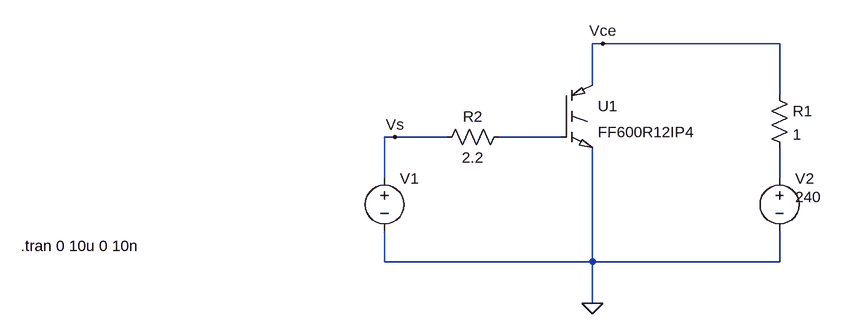
[diagram p0: schematic igbt-test.asc]
igbt-test.asc, the LTspice schematic file:
Version 4
SHEET 1 3552 680
WIRE 496 48 480 48
WIRE 768 48 496 48
WIRE 480 112 480 48
WIRE 768 128 768 48
WIRE 176 192 160 192
WIRE 256 192 176 192
WIRE 432 192 336 192
WIRE 160 256 160 192
WIRE 768 256 768 208
WIRE 160 384 160 336
WIRE 480 384 480 208
WIRE 480 384 160 384
WIRE 768 384 768 336
WIRE 768 384 480 384
WIRE 480 448 480 384
FLAG 480 448 0
FLAG 176 192 Vs
FLAG 496 48 Vce
SYMBOL voltage 160 240 R0
WINDOW 123 0 0 Left 0
WINDOW 39 0 0 Left 0
WINDOW 3 24 96 Invisible 2
SYMATTR Value PULSE(0 15 1u 1n 1n 5u 10u 2)
SYMATTR InstName V1
SYMBOL voltage 768 240 R0
WINDOW 3 24 44 Left 2
WINDOW 123 0 0 Left 0
WINDOW 39 0 0 Left 0
SYMATTR Value 240
SYMATTR InstName V2
SYMBOL res 752 112 R0
SYMATTR InstName R1
SYMATTR Value 1
SYMBOL res 352 176 R90
WINDOW 0 0 56 VBottom 2
WINDOW 3 32 56 VTop 2
SYMATTR InstName R2
SYMATTR Value 2.2
SYMBOL FF600R12IP4 432 112 R0
SYMATTR InstName U1
TEXT -400 360 Left 2 !.tran 0 10u 0 10n

The netlist it stands for:
* igbt-test.asc
V1 Vs 0 PULSE(0 15 1u 1n 1n 5u 10u 2)
V2 N002 0 240
R1 Vce N002 1
R2 N001 Vs 2.2
XU1 Vce N001 0 FF600R12IP4  ; pins C G E
.tran 0 10u 0 10n
.lib FF600R12IP4.lib
.backanno
.end